# Altium schematic sheet [Acoustics] STM32G4.SchDoc: STM32G4 Block
size B; Date: 12/27/2024; CheckedBy: John Ulm; Author: John Ulm; Organization: ORGANIZATION; Address1: ADDRESS 1; Address2: ADDRESS 2; Address3: ADDRESS 3; Address4: ADDRESS 4; Revision: -; SheetNumber: 4; SheetTotal: 6; ENG_APP_DATE: --/--/--; DSN_APP_DATE: --/--/--; CHK_APP_DATE: --/--/--
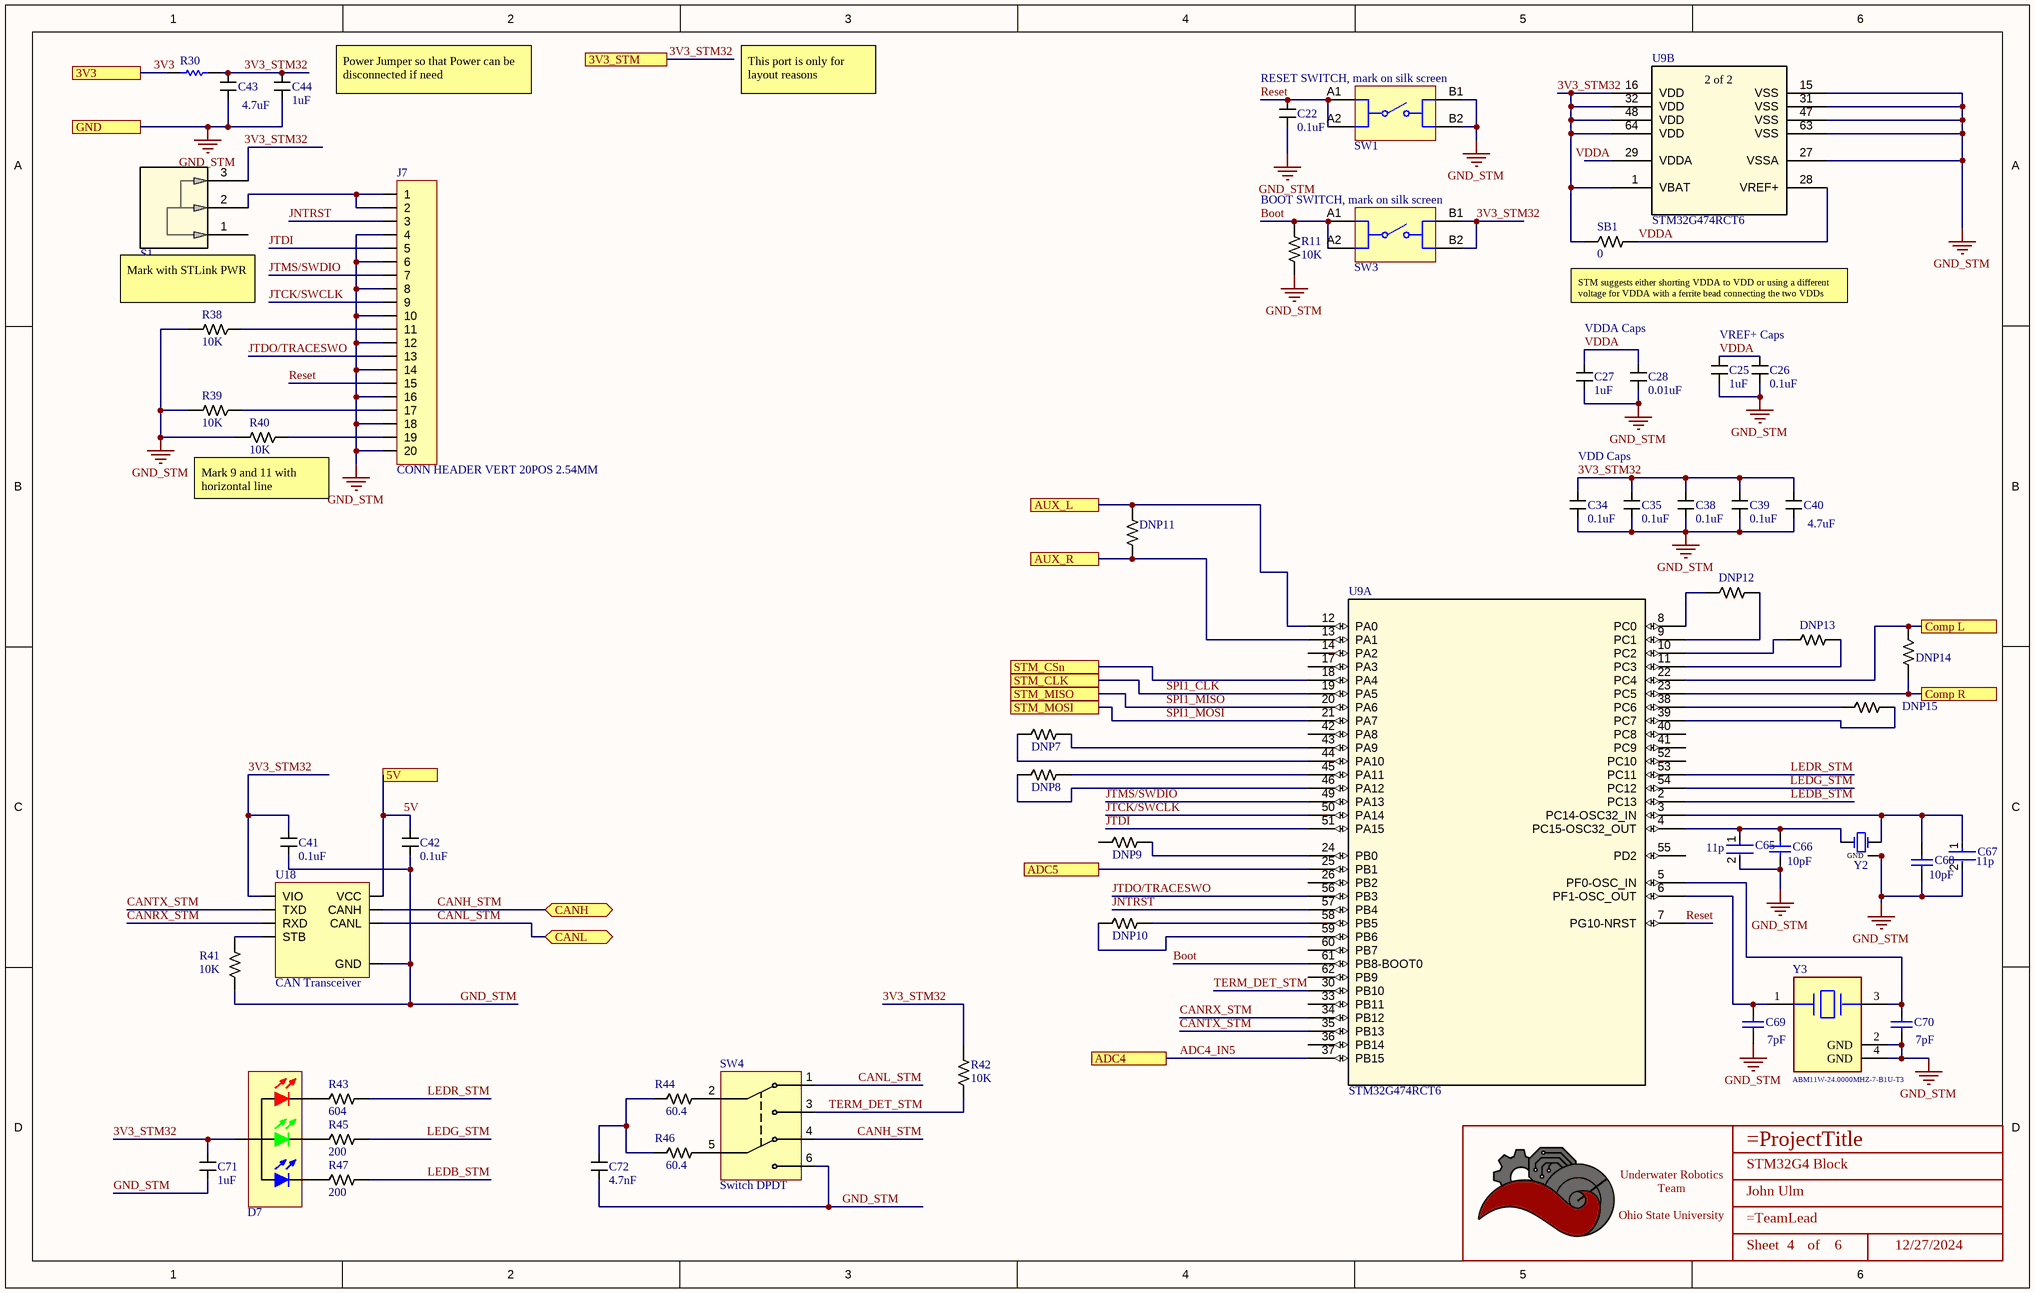
[diagram p0: [Acoustics] STM32G4.SchDoc]

## Parts
*?  Title_Block  [LOGO]  (value not drawn)  (graphical)
C22  value 0.1uF  [CAPACITOR_0402]  (hidden comment: 100nF Ceramic 25V)
C25  value 1uF  [CAPACITOR_0402]  (hidden comment: 1uF Ceramic 16V)
C26  value 0.1uF  [CAPACITOR_0402]  (hidden comment: 100nF Ceramic 25V)
C27  value 1uF  [CAPACITOR_0402]  (hidden comment: 1uF Ceramic 16V)
C28  value 0.01uF  [CAPACITOR_0603]  (hidden comment: 10nF Ceramic 6.3V)
C34  value 0.1uF  [CAPACITOR_0402]  (hidden comment: 100nF Ceramic 25V)
C35  value 0.1uF  [CAPACITOR_0402]  (hidden comment: 100nF Ceramic 25V)
C38  value 0.1uF  [CAPACITOR_0402]  (hidden comment: 100nF Ceramic 25V)
C39  value 0.1uF  [CAPACITOR_0402]  (hidden comment: 100nF Ceramic 25V)
C40  value 4.7uF  [CAPACITOR_0603]  (hidden comment: 4.7uF Ceramic 6.3V)
C41  value 0.1uF  [CAPACITOR_0402]  (hidden comment: 100nF Ceramic 25V)
C42  value 0.1uF  [CAPACITOR_0402]  (hidden comment: 100nF Ceramic 25V)
C43  value 4.7uF  [CAPACITOR_0603]  (hidden comment: 4.7uF Ceramic 6.3V)
C44  value 1uF  [CAPACITOR_0402]  (hidden comment: 1uF Ceramic 16V)
C65  value 11p  [FP-GCM155-0_05-IPC_B]  (hidden comment: GCM1555C1H110FA16D)
C66  Capacitance: 10pF  [CAPC1005X55X25ML05T05]  (hidden comment: CC0402JRNPO9BN100)
C67  value 11p  [FP-GCM155-0_05-IPC_B]  (hidden comment: GCM1555C1H110FA16D)
C68  Capacitance: 10pF  [CAPC1005X55X25ML05T05]  (hidden comment: CC0402JRNPO9BN100)
C69  value 7pF  [CAPC1005X56X25LL10T15]  (hidden comment: 04025A7R0CAT2A)
C70  value 7pF  [CAPC1005X56X25LL10T15]  (hidden comment: 04025A7R0CAT2A)
C71  value 1uF  [CAPACITOR_0402]  (hidden comment: 1uF Ceramic 16V)
C72  value 4.7nF  [CAPACITOR_0402]  (hidden comment: 4700pF Ceramic 25V)
D7  EAST1616RGBB4  [LED_0606_4SMD]  (value not drawn)
DNP7  DNP  [RESISTOR_0402]  (value not drawn)
DNP8  DNP  [RESISTOR_0402]  (value not drawn)
DNP9  DNP  [RESISTOR_0402]  (value not drawn)
DNP10  DNP  [RESISTOR_0402]  (value not drawn)
DNP11  DNP  [RESISTOR_0402]  (value not drawn)
DNP12  DNP  [RESISTOR_0402]  (value not drawn)
DNP13  DNP  [RESISTOR_0402]  (value not drawn)
DNP14  DNP  [RESISTOR_0402]  (value not drawn)
DNP15  DNP  [RESISTOR_0402]  (value not drawn)
J7  CONN HEADER VERT 20POS 2.54MM  [STM32_Connector]
R11  Value  (Ohms): 10K  [RESISTOR_0603]  (hidden comment: 10k Ohm 5% 1/10W)
R30  Jumper 2512(6432)  [RESC2512(6432)_L]  (value not drawn)
R38  Value  (Ohms): 10K  [RESISTOR_0603]  (hidden comment: 10k Ohm 5% 1/10W)
R39  Value  (Ohms): 10K  [RESISTOR_0603]  (hidden comment: 10k Ohm 5% 1/10W)
R40  Value  (Ohms): 10K  [RESISTOR_0603]  (hidden comment: 10k Ohm 5% 1/10W)
R41  Value  (Ohms): 10K  [RESISTOR_0402]  (hidden comment: 10k Ohm 1% 1/16W)
R42  Value  (Ohms): 10K  [RESISTOR_0402]  (hidden comment: 10k Ohm 1% 1/16W)
R43  Value  (Ohms): 604  [RESISTOR_0402]  (hidden comment: 604 Ohm 1% 1/16W)
R44  Value  (Ohms): 60.4  [RESISTOR_0402]  (hidden comment: 60.4 Ohm 1% 1/16W)
R45  Value  (Ohms): 200  [RESISTOR_0402]  (hidden comment: 200 Ohm 1% 1/16W)
R46  Value  (Ohms): 60.4  [RESISTOR_0402]  (hidden comment: 60.4 Ohm 1% 1/16W)
R47  Value  (Ohms): 200  [RESISTOR_0402]  (hidden comment: 200 Ohm 1% 1/16W)
S1  SS-12D07-VG 4 NS GA PA  [SS-12D07-VG 4 NS GA PA]  (value not drawn)
SB1  Value  (Ohms): 0  [RESISTOR_0603]  (hidden comment: 0 Ohm Jumper No Fit)
SW1  434123025826  [SMD_434123025826]  (value not drawn)
SW3  434123025826  [SMD_434123025826]  (value not drawn)
SW4  Switch DPDT  [CAS-220TA]
U9  STM32G474RCT6  [LQFP64-10x10mm]  (parts A,B of 2)
U18  CAN Transceiver  [SOIC-8]
Y2  XTAL OSC XO 32.7680KHZ 15 pF CMOS SMD  [4-SMD, NO LEAD CRYSTAL 3.2x2.5mm]  (value not drawn)
Y3  ABM11W-24.0000MHZ-7-B1U-T3  [FP-ABM11W-MFG]

## Ports
3V3, 3V3_STM, 5V, ADC4, ADC5, AUX_L, AUX_R, CANH (bidir), CANL (bidir), Comp L, Comp R, GND, STM_CLK, STM_CSn, STM_MISO, STM_MOSI

## Nets
GND_STM: C22.2 C25.2 C26.2 C27.2 C28.2 C34.2 C35.2 C38.2 C39.2 C40.2 C41.2 C42.2 C43.2 C44.2 C65.2 C66.1 C67.2 C68.1 C69.1 C70.1 C71.2 C72.1 J7.4 J7.6 J7.8 J7.10 J7.12 J7.14 J7.16 J7.18 J7.20 R11.2 R38.1 R39.1 R40.1 R41.2 SW1.B1 SW1.B2 SW4.6 U9.15(VSS) U9.27(VSSA) U9.31(VSS) U9.47(VSS) U9.63(VSS) U18.2(GND) Y2.1(GND) Y2.3 Y3.2(GND) Y3.4(GND) ; port GND
3V3: R30.1 ; port 3V3
3V3_STM32: C34.1 C35.1 C38.1 C39.1 C40.1 C41.1 C43.1 C44.1 C71.1 D7.4 R30.2 R42.1 S1.3 SB1.2 SW3.B1 SW3.B2 U9.1(VBAT) U9.16(VDD) U9.32(VDD) U9.48(VDD) U9.64(VDD) U18.5(VIO) ; port 3V3_STM
5V: C42.1 U18.3(VCC) ; port 5V
ADC4_IN5: U9.37(PB15) ; port ADC4
ADC5: U9.25(PB1) ; port ADC5
AUX_L: DNP11.1 U9.12(PA0) ; port AUX_L
AUX_R: DNP11.2 U9.13(PA1) ; port AUX_R
Boot: R11.1 SW3.A1 SW3.A2 U9.61(PB8-BOOT0)
CANH_STM: SW4.4 U18.7(CANH) ; port CANH
CANL_STM: SW4.1 U18.6(CANL) ; port CANL
CANRX_STM: U9.34(PB12) U18.4(RXD)
CANTX_STM: U9.35(PB13) U18.1(TXD)
Comp L: DNP14.2 U9.22(PC4) ; port Comp L
Comp R: DNP14.1 U9.23(PC5) ; port Comp R
JNTRST: J7.3 U9.57(PB4)
JTCK/SWCLK: J7.9 U9.50(PA14)
JTDI: J7.5 U9.51(PA15)
JTDO/TRACESWO: J7.13 U9.56(PB3)
JTMS/SWDIO: J7.7 U9.49(PA13)
LEDB_STM: R47.1 U9.2(PC13)
LEDG_STM: R45.1 U9.54(PC12)
LEDR_STM: R43.1 U9.53(PC11)
Reset: C22.1 J7.15 SW1.A1 SW1.A2 U9.7(PG10-NRST)
SPI1_CLK: U9.19(PA5) ; port STM_CLK
SPI1_MISO: U9.20(PA6) ; port STM_MISO
SPI1_MOSI: U9.21(PA7) ; port STM_MOSI
STM_CSn: U9.18(PA4) ; port STM_CSn
TERM_DET_STM: R42.2 SW4.3 U9.30(PB10)
VDDA: C25.1 C26.1 C27.1 C28.1 SB1.1 U9.28(VREF+) U9.29(VDDA)
NetC65_1: C65.1 C66.2 U9.4(PC15-OSC32_OUT) Y2.2
NetC67_1: C67.1 C68.2 U9.3(PC14-OSC32_IN) Y2.4
NetC69_2: C69.2 U9.6(PF1-OSC_OUT) Y3.1
NetC70_2: C70.2 U9.5(PF0-OSC_IN) Y3.3
NetC72_2: C72.2 R44.2 R46.2
NetD7_1: D7.1 R43.2
NetD7_2: D7.2 R45.2
NetD7_3: D7.3 R47.2
NetDNP7_1: DNP7.1 U9.43(PA9)
NetDNP7_2: DNP7.2 U9.44(PA10)
NetDNP8_1: DNP8.1 U9.45(PA11)
NetDNP8_2: DNP8.2 U9.46(PA12)
NetDNP9_1: DNP9.1 U9.24(PB0)
NetDNP10_1: DNP10.1 U9.58(PB5)
NetDNP10_2: DNP10.2 U9.59(PB6)
NetDNP12_1: DNP12.1 U9.9(PC1)
NetDNP12_2: DNP12.2 U9.8(PC0)
NetDNP13_1: DNP13.1 U9.11(PC3)
NetDNP13_2: DNP13.2 U9.10(PC2)
NetDNP15_1: DNP15.1 U9.39(PC7)
NetDNP15_2: DNP15.2 U9.38(PC6)
NetJ7_1: J7.1 J7.2 S1.2
NetJ7_11: J7.11 R38.2
NetJ7_17: J7.17 R39.2
NetJ7_19: J7.19 R40.2
NetR41_1: R41.1 U18.8(STB)
NetR44_1: R44.1 SW4.2
NetR46_1: R46.1 SW4.5

Not connected (* = marked no-connect by the designer): DNP9 2; S1 1; U9 14(PA2) 17(PA3) 26(PB2) 33(PB11) 36(PB14) 40(PC8) 41(PC9) 42(PA8) 52(PC10) 55(PD2) 60(PB7) 62(PB9)

## Notes on the sheet
- Power Jumper so that Power can be disconnected if need
- This port is only for layout reasons
- RESET SWITCH, mark on silk screen
- (near SW3) BOOT SWITCH, mark on silk screen
- Mark with STLink PWR
- (near SB1) STM suggests either shorting VDDA to VDD or using a different voltage for VDDA with a ferrite bead connecting the two VDDs
- VDDA Caps
- VREF+ Caps
- (near R40) Mark 9 and 11 with horizontal line
- VDD Caps
- DWG. NO.
- REV.
- SHT.
- THIS DOCUMENT AND THE DATA DISCLOSED HEREIN OR HEREWITH IS THE PROPERTY OF ALTIUM LIMITED AND MAY BE FREELY DISTRIBUTED IN WHOLE. NO RIGHTS ARE RESERVED OR EXPRESS OR IMPLIED WARANTEE GIVEN.
- REVISION
- DESCRIPTION
- DATE
- APPROVED
- ENG:
- APPROVALS
- PROJECT
- DSN:
- CHK:
- REFERENCE DOCUMENTS
- PROJECT REVISION:
- TITLE
- DOCUMENT REVISION:
- DESIGN ITEM:
- BOM:
- FAB DWG:
- PCB DWG:
- ASSY DWG:
- SCALE:
- SIZE
- B
- CAGE CODE
- FILE NAME
- DWG NO.
- SHEET
- OF
- REV
- (in symbol STM32G474RCT6, part B) 2 of 2
- (in symbol Title_Block) Underwater Robotics Team / Ohio State University; Sheet; of

## Library data of the parts
*? = Title_Block: UWRT Schematic Title Block Template / Created June 2021, Dylan Trainor
C22 C26 C34 C35 C38 C39 C41 C42 = CAPACITOR_0.1uF_0402: Cap 100nF 25V +/-10% / Ceramic 0402; Made By: Robert Pafford; Tolerance: +/- 10%; Voltage: 25V
  C22 C26 C34 C35 C38 C39: Supplier 1: Future Electronics; Supplier Part Number 1: 7029569
  C41 C42: Supplier 1: Digi-Key; Supplier Part Number 1: 478-7868-1-ND
C25 C27 C44 C71 = CAPACITOR_1uF_0402: Cap 1uF 16V +/-10% / Ceramic 0402; Made By: Robert Pafford; Tolerance: +/- 10%; Voltage: 16V; Supplier 1: Digi-Key; Supplier Part Number 1: 478-0402YD105KAT4ADKR-ND
C28 = CAPACITOR_0.01uF_0603: Cap 10nF 6.3V +/-20% / Ceramic 0603; Tolerance: +/- 10%; Made By: Flip B; ComponentLink1Description: Datsheet; ComponentLink1URL: https://www.mouser.com/datasheet/2/212/KEM_C1002_X7R_SMD-1102033.pdf; Voltage: 6.3V; Supplier 1: Mouser; Supplier Part Number 1: 80-C0603C103K9R
C40 C43 = CAPACITOR_4.7uF_0603: Cap 4.7uF 6.3V +/-10% / Ceramic 0603; Made By: Robert Pafford; Tolerance: +/- 10%; Voltage: 6.3V; Supplier 1: Digi-Key; Supplier Part Number 1: 1276-2087-1-ND
C65 C67 = CMP-06035-004581-1: Ceramic Capacitor for Automotive 11pF ±1% 50VDC C0G 0402 Paper T/R
C66 C68 = CMP-2100-03589-1: Chip Capacitor, 10 pF, +/- 5%, 50 V, -55 to 125 degC, 0402 (1005 Metric), RoHS, Tape and Reel; Manufacturer: Yageo; Insulation Resistance: 100GR; Voltage Rating (DC): 50V; Dielectric Material: Ceramic; Temperature Coefficient: 30ppm/degC; Dielectric: C0G; Termination: SMD/SMT; Package Reference: 0402; Lead Free: LeadFree; Composition: Ceramic; Tolerance: 5%; Case Code (Metric): 1005; Voltage Rating: 50V; Packaging: TapeandReel; Manufacturer URL: http://www.yageo.com/; REACH SVHC: NoSVHC; Max Operating Temperature: 125degC; Length: 1mm; Mount: SurfaceMount; Depth: 0.5mm; Min Operating Temperature: -55degC; Number of Pins: 2; Width: 0.02inch; Datasheet Version: Rev. 14, 07/2016; Package Quantity: 1; Datasheet URL: http://www.yageo.com/documents/recent/UPY-GP_NP0_16V-to-50V_14.pdf; Case Code (Imperial): 0402; RoHSCompliant: True; Radiation Hardening: No; Height: 0.5mm; Case/Package: 0402; Thickness: 0.022inch; Package Description: 2-Pin Surface Mount Device, Body 1 x 0.5 mm; Voltage: 50V
C69 C70 = CMP-2008-02683-1: Manufacturer: AVX Interconnect / Elco; Part Number: 04025A7R0CAT2A
C72 = CAPACITOR_0.0047uF_0402: 4700 pF +/-10% 25V Ceramic Capacitor X7R 0402; Made By: Robert Pafford; Tolerance: +/- 10%; Voltage: 25V; Supplier 1: Digi-Key; Supplier Part Number 1: 478-6195-1-ND
D7 = LED_RGB_4SMD: LED RGB CLEAR 4SMD; Made By: Robert Pafford; Red Forward Voltage: 1.8V; Red Forward Current: 5mA; Green Forward Voltage: 2.8V; ComponentLink1Description: Datasheet; ComponentLink1URL: https://everlightamericas.com/index.php?controller=attachment&id_attachment=3220; Package: 4-SMD; Green Forward Current: 5mA; Blue Forward Voltage: 2.8V; Blue Forward Current: 5mA; Color: RGB; Supplier 1: Digi-Key; Supplier Part Number 1: 1080-1552-1-ND
DNP7-DNP15 = DNP_0402: Do Not Populate 0402
J7 = 302-S201: Supplier 1: Digikey; Supplier Part Number 1: ED10524-ND
R11 R38-R40 = RESISTOR_10K_0603: RES 10k OHM 5% 1/10W 0603; Tolerance: +/- 5%; Wattage: 1/8W; Made By: Robert Pafford; ComponentLink1Description: Datasheet; ComponentLink1URL: https://www.bourns.com/docs/product-datasheets/CRxxxxx.pdf; Supplier: Digikey; Digikey Part Numer: CR0603-JW-104ELFTR-ND; Supplier 1: Digi-Key; Supplier Part Number 1: 2019-RK73B1JTTD103JCT-ND
R30 = CMP-1018-00001-1: Jumper 2512 (6432 Metric); Tolerance: None; Case-EIA: 2512; Value: 0.00 Ohm; Case-Metric: 6432; Technology: SMT; Power: None
R41 R42 = RESISTOR_10K_0402: RES 10k OHM 1% 1/16W 0402; Tolerance: +/- 1%; Made By: Robert Pafford; Wattage: 1/16W; Supplier: Digikey; Digikey Part Numer: CR0603-JW-104ELFTR-ND; Supplier 1: Digi-Key; Supplier Part Number 1: YAG3436CT-ND
R43 = RESISTOR_604_0402: RES 604 OHM 1% 1/16W 0402; Tolerance: +/- 1%; Made By: Robert Pafford; Wattage: 1/16W; Supplier: Digikey; Digikey Part Numer: CR0603-JW-104ELFTR-ND; Supplier 1: Digi-Key; Supplier Part Number 1: 13-AC0402FR-07604RLCT-ND
R44 R46 = RESISTOR_60.4_0402: RES 60.4 OHM 1% 1/16W 0402; Tolerance: +/- 1%; Made By: Robert Pafford; Wattage: 1/16W; Supplier: Digikey; Digikey Part Numer: CR0603-JW-104ELFTR-ND; Supplier 1: Digi-Key; Supplier Part Number 1: 13-AC0402FR-0760R4LCT-ND
R45 R47 = RESISTOR_200_0402: RES 200 OHM 1% 1/16W 0402; Tolerance: +/- 1%; Made By: Robert Pafford; Wattage: 1/16W; Supplier: Digikey; Digikey Part Numer: CR0603-JW-104ELFTR-ND; Supplier 1: Digi-Key; Supplier Part Number 1: YAG3453CT-ND
S1 = SS-12D07-VG 4 NS GA PA: SWITCH SLIDE SPDT 300MA 30V; Supplier 1: Digikey; Supplier Part Number 1: CKN10397-ND
SB1 = JUMPER_0_0603: 0 Ohm Jumper No Fit for Solder Bridge; Made By: Robert Pafford; ComponentLink1Description: Digikey; ComponentLink1URL: https://www.digikey.com/en/products/detail/koa-speer-electronics-inc/RK73B1JTTD101J/9844701
SW1 SW3 = Tactile Switch SMD: WS-TASV J-Bend SMT Tact Switch, SPST-NO, 16VDC, 50mA, 260g; Manufacturer: Wurth Elektronik; Washable: No; ComponentLink1Description: Website Link; ComponentLink1URL: https://www.we-online.com/redexpert/article/434123025826?ad; ComponentLink2Description: Datasheet Link; ComponentLink2URL: https://www.we-online.com/redexpert/spec/434123025826?ad; Manufacturer Part Number: 434123025826; Category: Tact Switches; Match Code: WS-TASV; Mount: Surface Mount; Operating Temperature Max: 85°C; Operating Temperature Min: -40°C; Packaging: Tape and Reel; Length: 4.2mm; Width: 3.2mm; Height: 2.5mm; Circuit: SPST-NO; Contact Material: Stainless Steel; Contact Plating: Silver; Operation Force: 260g; Rated Current: 50mA; Rated Voltage: 16VDC; Terminal Material: Copper Alloy; Terminal Plating: Silver; Supplier 1: Mouser; Supplier Part Number 1: 710-434123025826
SW4 = CAS-220TA_CAN_TERM: GOLD SWITCH FLUSH SLIDE DPDT 100MA 6V; Made By: Robert Pafford; Voltage Rating: 6VDC; Current Rating: 100 mA; Switch Function: DPDT; Contact Finish: Gold; Supplier 1: Digi-Key; Supplier Part Number 1: CAS220JCT-ND
U9 = STM32G474RCT6: No Description Available; Mfr_Name: STMicroelectronics; RefDes: RefDes; Type: Type
U18 = TJA1442AT: CAN Interface IC High-Speed CAN Transceiver with Standby Mode; Made By: Robert Pafford; Max Data Rate: 5Mbps; Supplier 1: Mouser; Supplier Part Number 1: 771-TJA1442AT/0Z
Y2 = CRYSTAL_32.786kHz_SMD_SMALL: 32.768 kHz XO (Standard) CMOS Oscillator 1.62V ~ 3.63V Enable/Disable 4-SMD, No Lead; Value: 32.768; Capacitance: 15 pF
Y3 = CMP-27762-000556-1: Crystal 24MHz ±10ppm 7pF SMD-4 2mm x 1.6mm; RoHS Compliant: Yes